# EAGLE design v1 4 button (EAGLE 9.6.2)
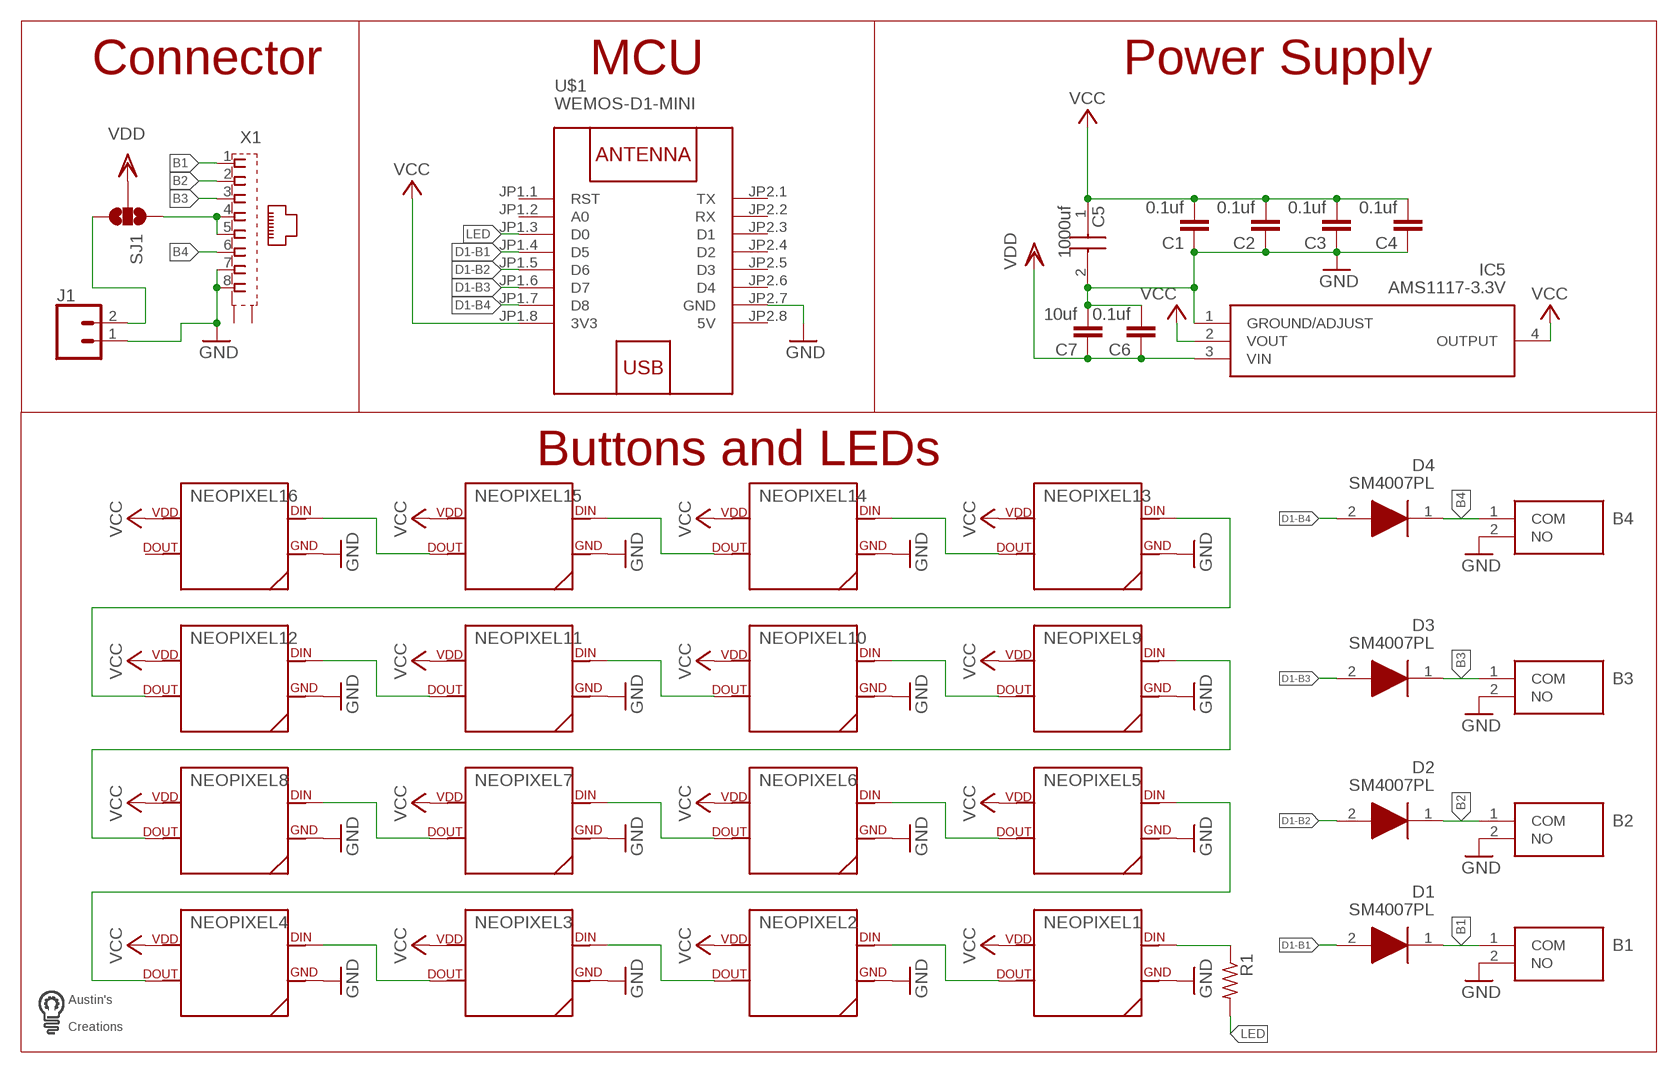
[diagram p0: schematic, sheet 1]

## Parts
B1  PTS636_SM25F_SMTR_LFS  [PTS636SM25FSMTRLFS]
B2  PTS636_SM25F_SMTR_LFS  [PTS636SM25FSMTRLFS]
B3  PTS636_SM25F_SMTR_LFS  [PTS636SM25FSMTRLFS]
B4  PTS636_SM25F_SMTR_LFS  [PTS636SM25FSMTRLFS]
C1  0.1uf  C-EUC0603  [C0603]
C2  0.1uf  C-EUC0603  [C0603]
C3  0.1uf  C-EUC0603  [C0603]
C4  0.1uf  C-EUC0603  [C0603]
C5  1000uf  EEE-0JA102P  [CAPAE1030X1050N]
C6  0.1uf  C-EUC0603  [C0603]
C7  10uf  C-EUC0603  [C0603]
D1  SM4007PL  [SODFL3718X125N]
D2  SM4007PL  [SODFL3718X125N]
D3  SM4007PL  [SODFL3718X125N]
D4  SM4007PL  [SODFL3718X125N]
IC5  AMS1117-3.3V  [SOT229P700X180-4N]
J1  CONN_025MM  [SCREWTERMINAL-5MM-2]
NEOPIXEL1  SK6812NEOPIXEL5050  [SK6812]
NEOPIXEL2  SK6812NEOPIXEL5050  [SK6812]
NEOPIXEL3  SK6812NEOPIXEL5050  [SK6812]
NEOPIXEL4  SK6812NEOPIXEL5050  [SK6812]
NEOPIXEL5  SK6812NEOPIXEL5050  [SK6812]
NEOPIXEL6  SK6812NEOPIXEL5050  [SK6812]
NEOPIXEL7  SK6812NEOPIXEL5050  [SK6812]
NEOPIXEL8  SK6812NEOPIXEL5050  [SK6812]
NEOPIXEL9  SK6812NEOPIXEL5050  [SK6812]
NEOPIXEL10  SK6812NEOPIXEL5050  [SK6812]
NEOPIXEL11  SK6812NEOPIXEL5050  [SK6812]
NEOPIXEL12  SK6812NEOPIXEL5050  [SK6812]
NEOPIXEL13  SK6812NEOPIXEL5050  [SK6812]
NEOPIXEL14  SK6812NEOPIXEL5050  [SK6812]
NEOPIXEL15  SK6812NEOPIXEL5050  [SK6812]
NEOPIXEL16  SK6812NEOPIXEL5050  [SK6812]
R1  R-US_R0603  [R0603]
SJ1  SOLDERJUMPER_2WAYPASTE1&2  [SJ_3_PASTE1&2]
U$1  WEMOS-D1-MINI  [WEMOS-D1-MINI]
U$2  LOGO  [LOGO]
X1  0446200002  [0446200002]

## Nets
B1: B1.1(COM) D1.1(K) X1.1
B2: B2.1(COM) D2.1(K) X1.2
B3: B3.1(COM) D3.1(K) X1.3
B4: B4.1(COM) D4.1(K) X1.6
D1-B1: D1.2(A) U$1.JP1.4(D5)
D1-B2: D2.2(A) U$1.JP1.5(D6)
D1-B3: D3.2(A) U$1.JP1.6(D7)
D1-B4: D4.2(A) U$1.JP1.7(D8)
GND: B1.2(NO) B2.2(NO) B3.2(NO) B4.2(NO) C1.1 C2.1 C3.1 C4.1 C5.2(-) C6.2 C7.2 IC5.1(GROUND/ADJUST) J1.1 NEOPIXEL1.3(GND) NEOPIXEL2.3(GND) NEOPIXEL3.3(GND) NEOPIXEL4.3(GND) NEOPIXEL5.3(GND) NEOPIXEL6.3(GND) NEOPIXEL7.3(GND) NEOPIXEL8.3(GND) NEOPIXEL9.3(GND) NEOPIXEL10.3(GND) NEOPIXEL11.3(GND) NEOPIXEL12.3(GND) NEOPIXEL13.3(GND) NEOPIXEL14.3(GND) NEOPIXEL15.3(GND) NEOPIXEL16.3(GND) U$1.JP2.7(GND) X1.7 X1.8
LED: R1.2 U$1.JP1.3(D0)
N$1: NEOPIXEL1.4(DIN) R1.1
N$2: NEOPIXEL1.2(DOUT) NEOPIXEL2.4(DIN)
N$3: NEOPIXEL2.2(DOUT) NEOPIXEL3.4(DIN)
N$4: NEOPIXEL3.2(DOUT) NEOPIXEL4.4(DIN)
N$5: NEOPIXEL4.2(DOUT) NEOPIXEL5.4(DIN)
N$6: NEOPIXEL8.2(DOUT) NEOPIXEL9.4(DIN)
N$7: NEOPIXEL12.2(DOUT) NEOPIXEL13.4(DIN)
N$8: NEOPIXEL5.2(DOUT) NEOPIXEL6.4(DIN)
N$9: NEOPIXEL9.2(DOUT) NEOPIXEL10.4(DIN)
N$10: NEOPIXEL13.2(DOUT) NEOPIXEL14.4(DIN)
N$11: NEOPIXEL6.2(DOUT) NEOPIXEL7.4(DIN)
N$12: NEOPIXEL10.2(DOUT) NEOPIXEL11.4(DIN)
N$13: NEOPIXEL14.2(DOUT) NEOPIXEL15.4(DIN)
N$14: NEOPIXEL7.2(DOUT) NEOPIXEL8.4(DIN)
N$15: NEOPIXEL11.2(DOUT) NEOPIXEL12.4(DIN)
N$16: NEOPIXEL15.2(DOUT) NEOPIXEL16.4(DIN)
N$17: SJ1.1 X1.4 X1.5
N$18: J1.2 SJ1.3
VCC: C1.2 C2.2 C3.2 C4.2 C5.1(+) IC5.2(VOUT) IC5.4(OUTPUT) NEOPIXEL1.1(VDD) NEOPIXEL2.1(VDD) NEOPIXEL3.1(VDD) NEOPIXEL4.1(VDD) NEOPIXEL5.1(VDD) NEOPIXEL6.1(VDD) NEOPIXEL7.1(VDD) NEOPIXEL8.1(VDD) NEOPIXEL9.1(VDD) NEOPIXEL10.1(VDD) NEOPIXEL11.1(VDD) NEOPIXEL12.1(VDD) NEOPIXEL13.1(VDD) NEOPIXEL14.1(VDD) NEOPIXEL15.1(VDD) NEOPIXEL16.1(VDD) U$1.JP1.8(3V3)
VDD: C6.1 C7.1 IC5.3(VIN) SJ1.2
Unconnected: NEOPIXEL16.2(DOUT) U$1.JP1.1(RST) U$1.JP1.2(A0) U$1.JP2.1(TX) U$1.JP2.2(RX) U$1.JP2.3(D1) U$1.JP2.4(D2) U$1.JP2.5(D3) U$1.JP2.6(D4) X1.S@1(S1) X1.S@2(S2)

## Notes on the sheet
- Connector | MCU | Power Supply
- Buttons and LEDs

## Power pins joined to a net without a drawn wire
5V: U$1.JP2.8(5V)

## Library data of the parts
B1-B4 = SamacSys_Parts:PTS636_SM25F_SMTR_LFS: Tactile Switches Tact 50mA 12VDC, 6.0x3.5, 2.5mm H, 180gf, F leads, No ground pin, White Actuator Source: Datasheet <https://ms.componentsearchengine.com/Datasheets/1/PTS636 SM25F SMTR LFS.pdf>; ARROW_PART_NUMBER: PTS636 SM25F SMTR LFS; ARROW_PRICE-STOCK: https://www.arrow.com/en/products/pts636-sm25f-smtr-lfs/ck; DESCRIPTION: Tactile Switches Tact 50mA 12VDC, 6.0x3.5, 2.5mm H, 180gf, F leads, No ground pin, White Actuator; HEIGHT: 2.7mm; MANUFACTURER_NAME: C & K COMPONENTS; MANUFACTURER_PART_NUMBER: PTS636 SM25F SMTR LFS; MOUSER_PART_NUMBER: 611-PTS636SM25FSMTRL; MOUSER_PRICE-STOCK: https://www.mouser.co.uk/ProductDetail/CK/PTS636-SM25F-SMTR-LFS?qs=vLWxofP3U2wcBTQSwfMFOw%3D%3D
C1-C4 C6 C7 = rcl:C-EU: CAPACITOR, European symbol; SPICEPREFIX: C
C5 = SamacSys_Parts:EEE-0JA102P: Panasonic 1000uF 6.3 V Aluminium Electrolytic Capacitor G, S(V) Series 2000h 10 x 10.2mm Source: Datasheet <https://componentsearchengine.com/Datasheets/1/EEE-0JA102P.pdf>; DESCRIPTION: Panasonic 1000uF 6.3 V Aluminium Electrolytic Capacitor G, S(V) Series 2000h 10 x 10.2mm; HEIGHT: 10.5mm; MANUFACTURER_NAME: Panasonic; MANUFACTURER_PART_NUMBER: EEE-0JA102P; MOUSER_PART_NUMBER: 667-EEE-0JA102P; MOUSER_PRICE-STOCK: https://www.mouser.com/Search/Refine.aspx?Keyword=667-EEE-0JA102P
D1-D4 = SamacSys_Parts:SM4007PL: 1kV 1A 1.1V @ 1A SOD-123FL Diodes - General Purpose RoHS Source: Datasheet <https://datasheet.lcsc.com/szlcsc/1903051030_MDD-Jiangsu-Yutai-Elec-SM4007PL_C64898.pdf>; DESCRIPTION: 1kV 1A 1.1V @ 1A SOD-123FL Diodes - General Purpose RoHS; HEIGHT: 1.25mm; MANUFACTURER_NAME: MDD(Microdiode Electronics); MANUFACTURER_PART_NUMBER: SM4007PL
IC5 = SamacSys_Parts:AMS1117-3.3V: 1A LOW DROPOUT VOLTAGE REGULATOR, SOT-223 Source: Datasheet <http://www.advanced-monolithic.com/pdf/ds1117.pdf>; DESCRIPTION: 1A LOW DROPOUT VOLTAGE REGULATOR, SOT-223; HEIGHT: 1.8mm; MANUFACTURER_NAME: Advanced Monolithic Systems; MANUFACTURER_PART_NUMBER: ams1117-3.3v
J1 = SparkFun-Connectors:CONN_02: Multi connection point. Often used as Generic Header-pin footprint for 0.1 inch spaced/style header connections On any of the 0.1 inch spaced packages, you can populate with these: Break Away Headers - Straight <https://www.sparkfun.com/products/116> (PRT-00116) Break Away Male Headers - Right Angle <https://www.sparkfun.com/products/553> (PRT-00553) Female Headers <https://www.sparkfun.com/products/115> (PRT-00115) Break Away Headers - Machine Pin <https://www.sparkfun.com/products/117> (PRT-00117) Break Away Female Headers - Swiss Machine Pin <https://www.sparkfun.com/products/743> (PRT-00743) For SCREWTERMINALS and SPRING TERMINALS visit here: Screw Terimnals on SparkFun.com <https://www.sparkfun.com/search/results?term=Screw+Terminals> (5mm/3.5mm/2.54mm spacing) This device is also useful as a general connection point to wire up your design to another part of your project. Our various solder wires solder well into these plated through hole pads. Hook-Up Wire - Assortment (Stranded, 22 AWG) <https://www.sparkfun.com/products/11375> (PRT-11375) Hook-Up Wire - Assortment (Solid Core, 22 AWG) <https://www.sparkfun.com/products/11367> (PRT-11367) View the entire wire category on our website here <https://www.sparkfun.com/categories/141> Special notes: Molex polarized connector foot print use with: PRT-08233 with associated crimp pins and housings. 2.54_SCREWTERM for use with PRT-10571. 3.5mm Screw Terminal footprints for PRT-08084 5mm Screw Terminal footprints for use with PRT-08432; SF_SKU: PRT-08432
NEOPIXEL1-NEOPIXEL16 = custom parts:SK6812: for 5050 sk6812 LED
R1 = resistor:R-US_: RESISTOR, American symbol
SJ1 = SparkFun-Retired:SOLDERJUMPER_2WAY: Solder Jumper 2 way solder jumper
U$1 = diy-modules:WEMOS-D1-MINI: WEMOS D1 mini: Mini Wi-Fi Board based on ESP-8266 device More details can be found here: https://www.wemos.cc/product/d1-mini.html Click here to find device on ebay.com <http://www.ebay.com/sch/wemos+d1+mini+nodemcu>
U$2 = custom parts:LOGO
X1 = custom parts:0446200002: RJ-45 INVERTED MODULAR JACK ASSEMBLY WITH RJ-11 KEEPOUT FEATURE Source: Data sheet <http://www.farnell.com/datasheets/73207.pdf> MOLEX 0446200002 BUCHSE, RJ45, GESCHIRMT Source: Farnell <http://de.farnell.com/molex/0446200002/buchse-rj45-geschirmt/dp/9251910?ost=9251910>; MF: MOLEX; MPN: 0446200002; OC_FARNELL: 9251910

## Board
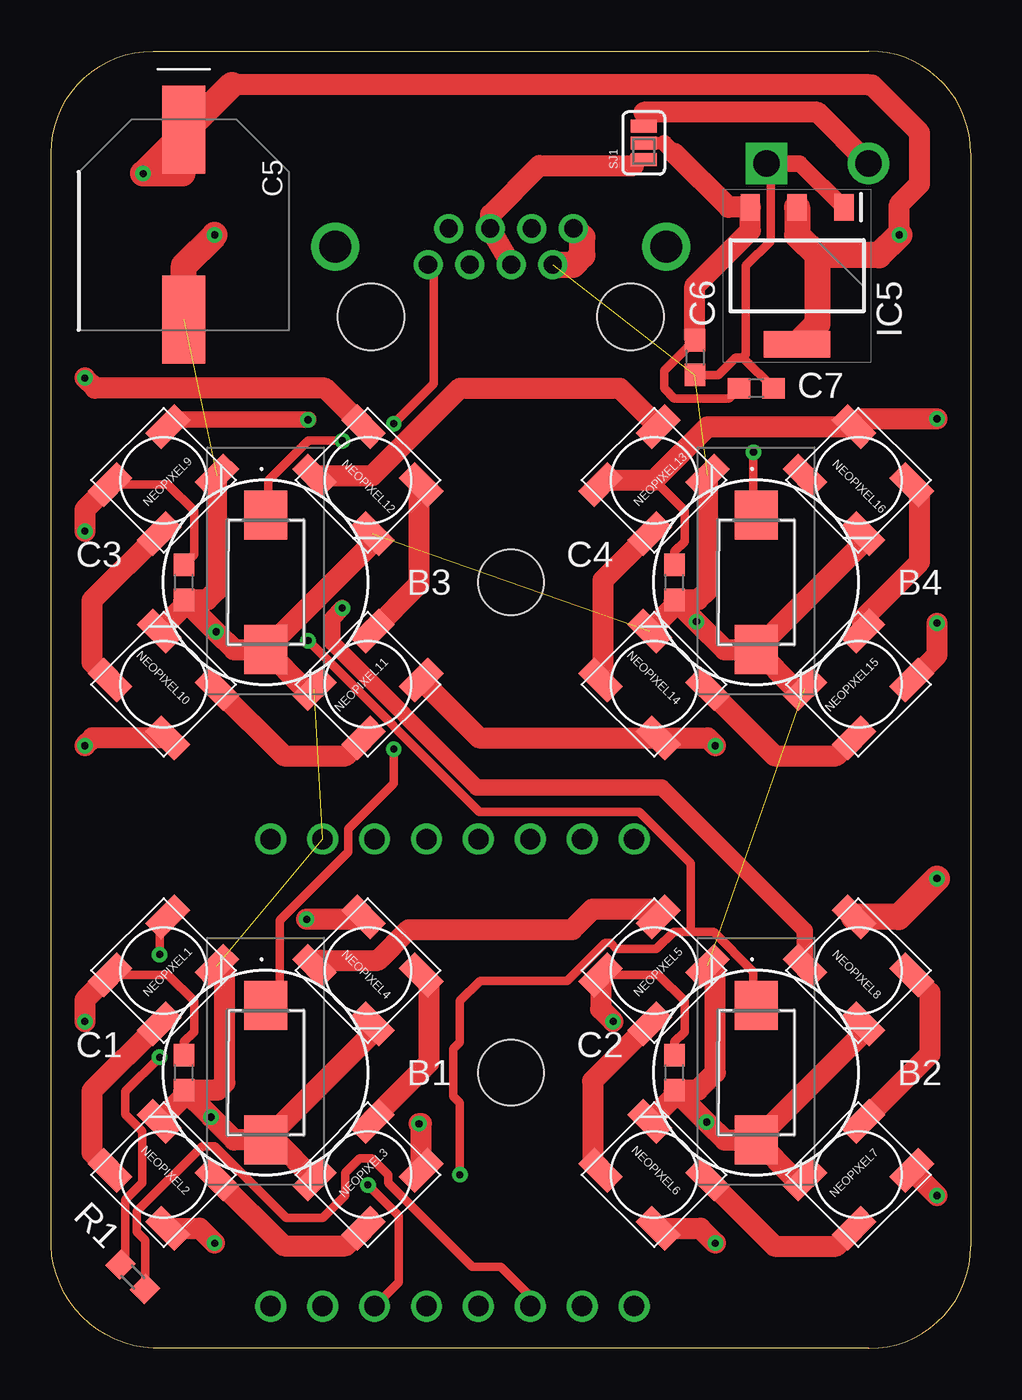
[diagram p1: board, top side]
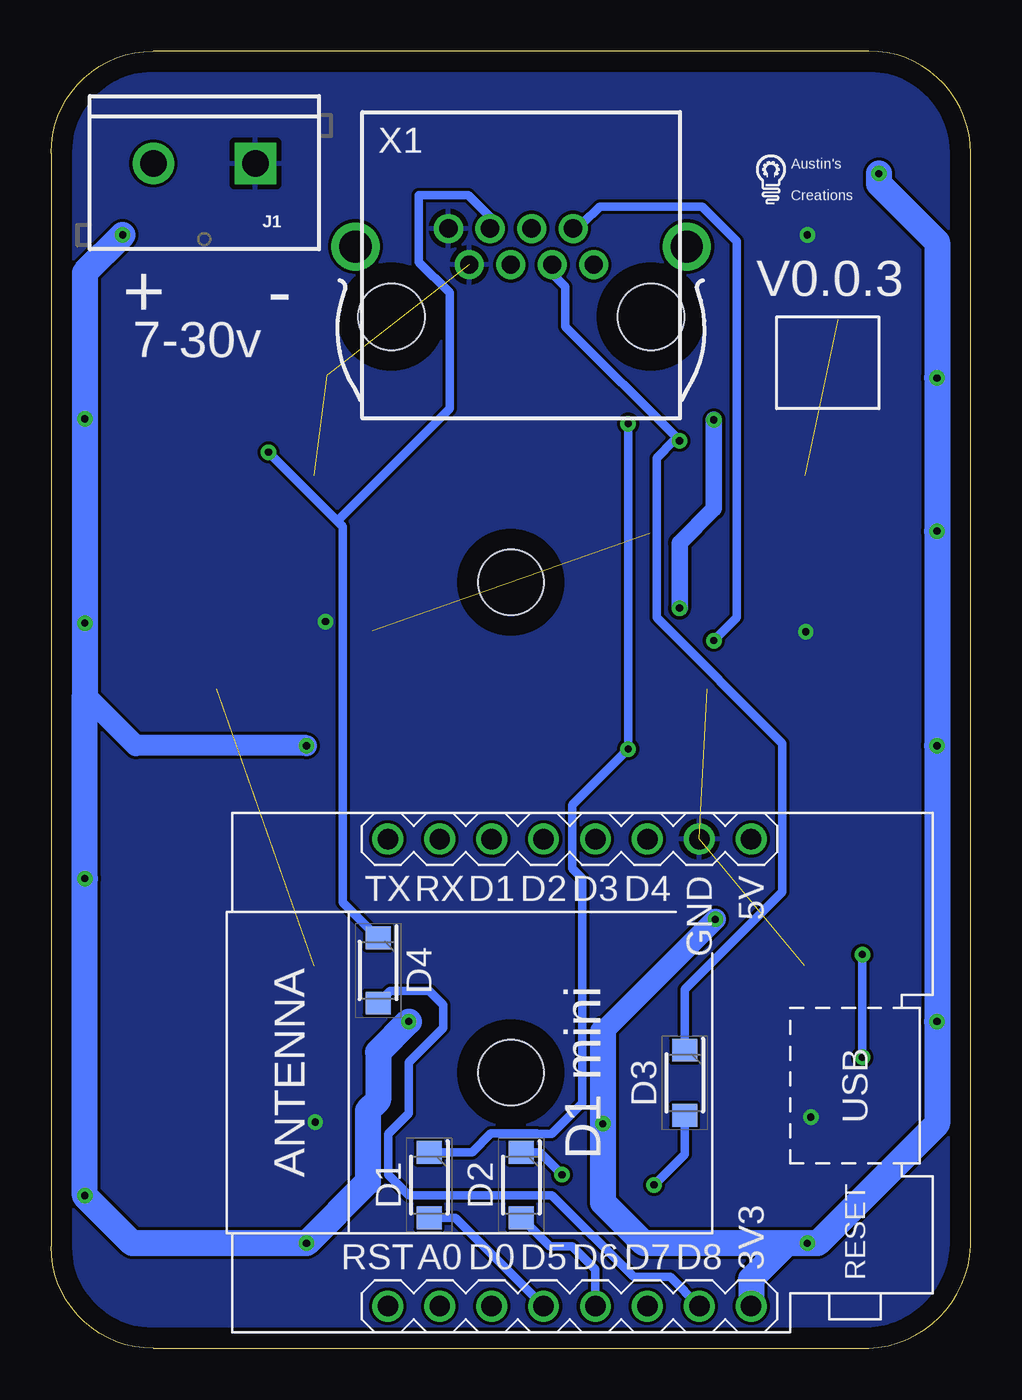
[diagram p2: board, bottom side, seen from below]

Size 45 x 63.5 mm. Coordinates in mm from the lower left corner, seen from the top.
Outline: 0,5.5 0,58.5 arc-90 5,63.5 40,63.5 arc-90 45,58.5 45,5 arc-90 40,0 5,0 arc-90 0,5.5
Copper layers (1*16): Top 0.035mm / dielectric 1.5mm / Bottom 0.035mm
Design rules "default *": minimum track width 16mil, minimum drill 0.35mm, track to track 6mil, track to pad 6mil, pad to pad 6mil, via to via 6mil, smd to smd 6mil, copper to edge 40mil, drill to drill 6mil, minimum pad ring 10mil, minimum via ring 8mil, stop-mask expansion 4mil, vias tented up to drill 0mil, thermal gap 10mil
Holes 3.2 mm at 22.5,37.5 22.5,13.5

### Footprints (pad centres in the part's own frame; a part is rotated, then mirrored left to right if it is on the bottom)
PTS636SM25FSMTRLFS = smd 2.4 x 2.1: 1 -3.3,0; 2 3.3,0
C0603 = smd 1.1 x 1: 1 -0.85,0; 2 0.85,0
CAPAE1030X1050N = smd 4.3 x 2.1: 1 -4.65,0; 2 4.65,0
SODFL3718X125N = smd 1.12 x 1.22: 1 -1.6,0; 2 1.6,0
SOT229P700X180-4N = smd 1.3 x 0.95: 1 -3.35,2.29; 2 -3.35,0; 3 -3.35,-2.29 | smd 1.3 x 3.25: 4 3.35,0
SCREWTERMINAL-5MM-2 = drill 1.3 pad 2.032 square: 1 0,0 | drill 1.3 pad 2.032: 2 5,0
SK6812 = smd 2 x 1.1: 1 -2,1.7; 2 -2,-1.7; 3 2,-1.7; 4 2,1.7
R0603 = smd 1 x 1.1: 1 -0.85,0; 2 0.85,0
SJ_3_PASTE1&2 = smd 0.635 x 1.27: 1 -0.813,0; 2 0,0; 3 0.813,0
WEMOS-D1-MINI = drill 1: JP1.1 -11.43,9.525; JP1.2 -11.43,6.985; JP1.3 -11.43,4.445; JP1.4 -11.43,1.905; JP1.5 -11.43,-0.635; JP1.6 -11.43,-3.175; JP1.7 -11.43,-5.715; JP1.8 -11.43,-8.255; JP2.1 11.43,9.525; JP2.2 11.43,6.985; JP2.3 11.43,4.445; JP2.4 11.43,1.905; JP2.5 11.43,-0.635; JP2.6 11.43,-3.175; JP2.7 11.43,-5.715; JP2.8 11.43,-8.255
0446200002 = drill 0.889 pad 1.422: 1 3.556,2.54; 2 2.54,4.318; 3 1.524,2.54; 4 0.508,4.318; 5 -0.508,2.54; 6 -1.524,4.318; 7 -2.54,2.54; 8 -3.556,4.318 | drill 1.575 pad 2.286: S@1 -8.103,3.429; S@2 8.103,3.429 | hole 3.251: 6.35,0; -6.35,0

### Placement (x,y rotation side)
B1  10.5,13.5 270 top
B2  34.5,13.5 270 top
B3  10.5,37.5 270 top
B4  34.5,37.5 270 top
C1  6.5,13.5 90 top
C2  30.5,13.5 90 top
C3  6.5,37.5 90 top
C4  30.5,37.5 90 top
C5  6.5,55 270 top
C6  31.5,48.5 270 top
C7  34.5,47 0 top
D1  26.5,8 270 bottom
D2  22,8 270 bottom
D3  14,13 270 bottom
D4  29,18.5 270 bottom
IC5  36.5,52.5 270 top
J1  35,58 180 bottom
NEOPIXEL1  5.5,18.5 45 top
NEOPIXEL2  5.5,8.5 135 top
NEOPIXEL3  15.5,8.5 225 top
NEOPIXEL4  15.5,18.5 315 top
NEOPIXEL5  29.5,18.5 45 top
NEOPIXEL6  29.5,8.5 135 top
NEOPIXEL7  39.5,8.5 225 top
NEOPIXEL8  39.5,18.5 315 top
NEOPIXEL9  5.5,42.5 45 top
NEOPIXEL10  5.5,32.5 135 top
NEOPIXEL11  15.5,32.5 225 top
NEOPIXEL12  15.5,42.5 315 top
NEOPIXEL13  29.5,42.5 45 top
NEOPIXEL14  29.5,32.5 135 top
NEOPIXEL15  39.5,32.5 225 top
NEOPIXEL16  39.5,42.5 315 top
R1  4,3.5 315 top
SJ1  29,59 90 top
U$1  19,13.5 90 bottom
U$2  10.5,56 0 bottom
X1  22,50.5 0 bottom

### Tracks (layer width: path | path; a pad name or v marks a point on that pad's centre or on a via)
B1  (via drill 0.35)
  Top 0.406: 11.18,17.04 10.62,17.04 B1.1 11.18,17.04 | v16.76,45.26 18.72,47.22 18.72,52.81 X1.1 | v16.76,29.34 16.76,27.66 14.53,25.43 14.53,24.31 11.18,20.95 11.18,17.04
  Bottom 0.406: v16.76,45.26 v16.76,29.34 19.5,26.6 19.5,23.5 19,23 19,12 20.5,10.5 21.23,10.5 21.24,10.52 23.48,10.52 24.4,9.6 D1.1
B2  (via drill 0.35)
  Top 0.406: 31.29,20.4 30.46,20.4 29.62,19.56 27.66,19.56 27.38,19.84 27.1,19.84 25.26,18 21,18 20,17 20,14.99 19.68,14.67 19.68,12.33 20,12.01 v20,8.5 | 31.29,20.4 32.41,20.4 34.37,18.44 34.37,17.04 B2.1 | v12.57,34.65 20.96,26.26 28.78,26.26 31.29,23.75 31.29,20.4
  Bottom 0.406: v12.57,34.65 11.46,35.76 11.46,54.2 13.13,55.88 18.16,55.88 19,55.04 19.28,55.04 X1.2 | v20,8.5 21.1,9.6 D2.1
B3  (via drill 0.35)
  Top 0.406: v14.25,44.42 12.57,44.42 10.62,42.47 10.62,41.07 B3.1
  Bottom 0.406: X1.3 20.68,52.81 19.84,51.97 19.84,50.01 v14.25,44.42 14.53,44.42 15.37,43.59 15.37,35.76 9.22,29.62 9.22,22.35 14,17.57 D3.1
B4  (via drill 0.35)
  Top 0.406: v34.37,43.87 34.37,41.07 B4.1
  Bottom 0.406: X1.6 23.47,55.04 23.47,55.32 24.59,56.44 27,56.44 27,53.17 25.51,51.68 25.51,45.99 31,40.5 | 31,40.5 30.73,40.23 30.73,21.83 D4.1 | 31,40.5 v34.37,43.87
D1-B1
  Bottom 0.406: U$1.JP1.4 25.24,6.4 D1.2
D1-B2
  Bottom 0.406: U$1.JP1.5 18.37,3.87 19.5,5 20.6,5 D2.2
D1-B3  (via drill 0.35)
  Top 0.406: v15.5,8 17,6.5 17,3.25 U$1.JP1.6
  Bottom 0.406: D3.2 14,9.5 v15.5,8
D1-B4
  Bottom 0.406: U$1.JP1.7 14.72,3.5 16.5,3.5 20.5,7.5 27.5,7.5 28.5,8.5 28.5,10.5 27.5,11.5 27.5,14 25.82,15.68 25.82,16.82 26.5,17.5 28.4,17.5 D4.2
GND  (via drill 0.35)  (7 unrouted)
  Top 0.406: C6.2 32.65,47.65 33.5,48.5 33.85,48.5 | 33.85,48.5 C7.2 | 33.85,48.5 34,48.65 34,53 35.2,54.2 35.2,57.49 35,57.69 J1.1
  Top 0.813: J1.1 36.64,58 IC5.1
  Top 1.016: NEOPIXEL10.3 6.5,36.33 C3.1 | C3.1 v8.08,35.08 8.95,34.2 B3.2 | B3.2 12.41,32.29 NEOPIXEL11.3 | NEOPIXEL6.3 30.5,12.33 C2.1 | C2.1 v32.08,11.07 32.95,10.2 B2.2 | B2.2 36.41,8.29 NEOPIXEL7.3 | C2.1 31.65,12.65 32.5,13.5 32.5,18.33 NEOPIXEL5.3 | B2.2 39.71,15.41 NEOPIXEL8.3 | B1.2 10.97,10.2 NEOPIXEL3.3 | B1.2 15.71,15.41 NEOPIXEL4.3 | B1.2 8.95,10.2 v7.83,11.32 C1.1 | NEOPIXEL2.3 6.5,12.33 C1.1 | C1.1 8.15,12.65 8.5,13 8.5,18.33 NEOPIXEL1.3 | C3.1 7.65,36.65 8.12,37.12 NEOPIXEL9.3 | B3.2 15.71,39.41 NEOPIXEL12.3 | NEOPIXEL14.3 30.5,36.33 C4.1 | C4.1 v31.58,35.58 32.95,34.2 B4.2 | B4.2 36.41,32.29 NEOPIXEL15.3 | B4.2 39.71,39.41 NEOPIXEL16.3 | C4.1 31.65,36.65 32.12,37.12 NEOPIXEL13.3
  Top 1.27: 6.74,50.59 C5.2 6.5,53 v8,54.5 | X1.7 25.54,53.04 26,53.5 26,54.37 X1.8
  pour Bottom: 0,58.5 arc-90 5,63.5 40,63.5 arc-90 45,58.5 45,5 arc-90 40,0 5.5,0 arc-90 0,5.5
LED
  Top 0.406: U$1.JP1.3 23.45,2.56 22,4 20.6,4 16.5,8.1 16.5,8.5 15.7,9.3 15.1,9.3 14.4,8.6 14.4,7.5 13.3,6.4 11.5,6.4 8,9.9 7.4,9.9 4.2,6.7 4.2,5.7 4.6,5.3 R1.2
N$1  (via drill 0.35)
  Top 0.406: v5.31,14.25 3.63,12.57 3.63,11.46 4.47,10.62 4.47,8.1 3.63,7.26 3.63,4.19 R1.1 | v5.31,19.28 5.31,20.68 5.59,20.95 NEOPIXEL1.4
  Bottom 0.406: v5.31,19.28 v5.31,14.25
N$2
  Top 1.016: NEOPIXEL1.2 2,12.6 2,9.6 NEOPIXEL2.4
N$3
  Top 1.016: NEOPIXEL2.2 11.38,5.02 14.43,5.02 NEOPIXEL3.4
N$4
  Top 1.016: NEOPIXEL3.2 15.71,11.21 18.5,14 18.5,17.9 NEOPIXEL4.4
N$5
  Top 1.016: NEOPIXEL4.2 13.17,19 16,19 17.5,20.5 25.5,20.5 26.5,21.5 29.33,21.5 NEOPIXEL5.4
N$6  (via drill 0.35)
  Top 0.406: 6.15,45.45 5.87,45.17 NEOPIXEL9.4
  Top 0.813: NEOPIXEL8.2 36.88,20.45 29.87,27.47 20.84,27.47 13.75,34.56 13.75,35.73 v14.25,36.23 | 6.15,45.45 v12.57,45.45
  Bottom 0.813: v14.25,36.23 14.25,39.42 12.57,41.1 v12.57,45.45
N$7
  Top 1.016: NEOPIXEL12.2 15.71,42.71 20,47 27.83,47 NEOPIXEL13.4
N$8
  Top 1.016: NEOPIXEL5.2 26.5,13.1 26.5,9.1 NEOPIXEL6.4
N$9
  Top 1.016: NEOPIXEL9.2 2,36.6 2,33.6 NEOPIXEL10.4
N$10
  Top 1.016: NEOPIXEL13.2 27,37.6 27,32.83 NEOPIXEL14.4
N$11
  Top 1.016: NEOPIXEL6.2 35.4,5 38.4,5 NEOPIXEL7.4
N$12
  Top 1.016: NEOPIXEL10.2 11.4,29 14.4,29 NEOPIXEL11.4
N$13
  Top 1.016: NEOPIXEL14.2 35.4,29 38.4,29 NEOPIXEL15.4
N$14
  Top 1.016: NEOPIXEL8.4 43,17.4 43,14.4 NEOPIXEL7.2
N$15
  Top 1.016: NEOPIXEL11.2 18,37.4 18,42.17 NEOPIXEL12.4
N$16
  Top 1.016: NEOPIXEL15.2 39.71,35.71 42.5,38.5 42.5,41.9 NEOPIXEL16.4
N$17
  Top 0.61: SJ1.1 28.5,58.19 28.5,57.89
  Top 1.016: X1.5 X1.4 | X1.4 21.5,55.5 23.89,57.89 28.5,57.89
  Top 1.27: X1.4
N$18
  Top 0.61: 29,60.5 SJ1.3
  Top 1.016: 29,60.5 37.5,60.5 J1.2
VCC  (via drill 0.35)
  Top 0.406: C4.2 30.5,39 31,39.5 31,41 29.5,42.5 | NEOPIXEL9.1 5.71,42.29 7,41 7,38.85 C3.2 | C2.2 30.5,15 31,15.5 31,17 29.71,18.29 NEOPIXEL5.1 | C1.2 6.5,15 7,15.5 7,17 5.71,18.29 NEOPIXEL1.1
  Top 1.016: v43.35,7.48 NEOPIXEL7.1 | NEOPIXEL6.1 31.77,5.88 v32.5,5.15 | NEOPIXEL5.1 26.88,16.62 v27.5,16 | NEOPIXEL4.1 15.17,21 v12.5,21 | NEOPIXEL1.1 1.65,17.05 v1.65,16 | NEOPIXEL2.1 7.27,5.88 v8,5.15 | NEOPIXEL3.1 18.12,11 v18,11 | NEOPIXEL10.1 2.04,29.88 v1.65,29.5 | NEOPIXEL9.1 1.65,41.05 v1.65,40 | NEOPIXEL15.1 43.35,33.95 v43.35,35.5 | v43.35,45.5 39.67,45.5 NEOPIXEL16.1 32.12,45.12 29.5,42.5 27.1,42.5 NEOPIXEL13.1 | v32.5,29.5 32.12,29.88 NEOPIXEL14.1 20.95,29.88 NEOPIXEL11.1 | NEOPIXEL12.1 13.4,47 2.15,47 v1.65,47.5 | v41.5,54.5 41.5,56 42.5,57 42.5,59.5 40.17,61.84 40,61.85 8.85,61.85
  Top 1.27: C5.1 6.5,58.76 6.29,58.56 6.42,57.5 v4.5,57.5 8.85,61.85 | v43.35,23 41.47,21.12 NEOPIXEL8.1 | IC5.2 36.5,54.5 37.5,53.5 | 37.5,53.5 40.5,53.5 v41.5,54.5 | IC5.4 37.5,50.15 37.5,53.5
  Bottom 1.016: 18,15.5 v12.5,21 | v32.5,29.5 40.85,29.5 43.35,32
  Bottom 1.27: v4.5,57.5 4.5,57 1.65,54.15 v1.65,47.5 v1.65,40 v1.65,29.5 v1.65,16 1.65,11 7.5,5.15 v8,5.15 9,5.15 | 9,5.15 16,5.15 18,7.15 v18,11 18,15.5 | v41.5,54.5 43.35,52.65 v43.35,45.5 v43.35,35.5 43.35,32 v43.35,23 v43.35,7.48 41.02,5.15 v32.5,5.15 29.5,8.15 29.5,11.65 29,12.15 29,14.5 v27.5,16 | 9,5.15 10.75,3.41 U$1.JP1.8
VDD
  Top 0.406: C6.1 30,47.85 30,47 30.5,46.5 33.15,46.5 C7.1
  Top 0.61: SJ1.2 30,59
  Top 0.813: 30,59 30.5,58.5
  Top 1.016: 30.5,58.5 33.15,55.85 IC5.3 34.21,54.71 31.5,52 C6.1

### Text on the board
bPlace: V0.0.3 | + - | 7-30v